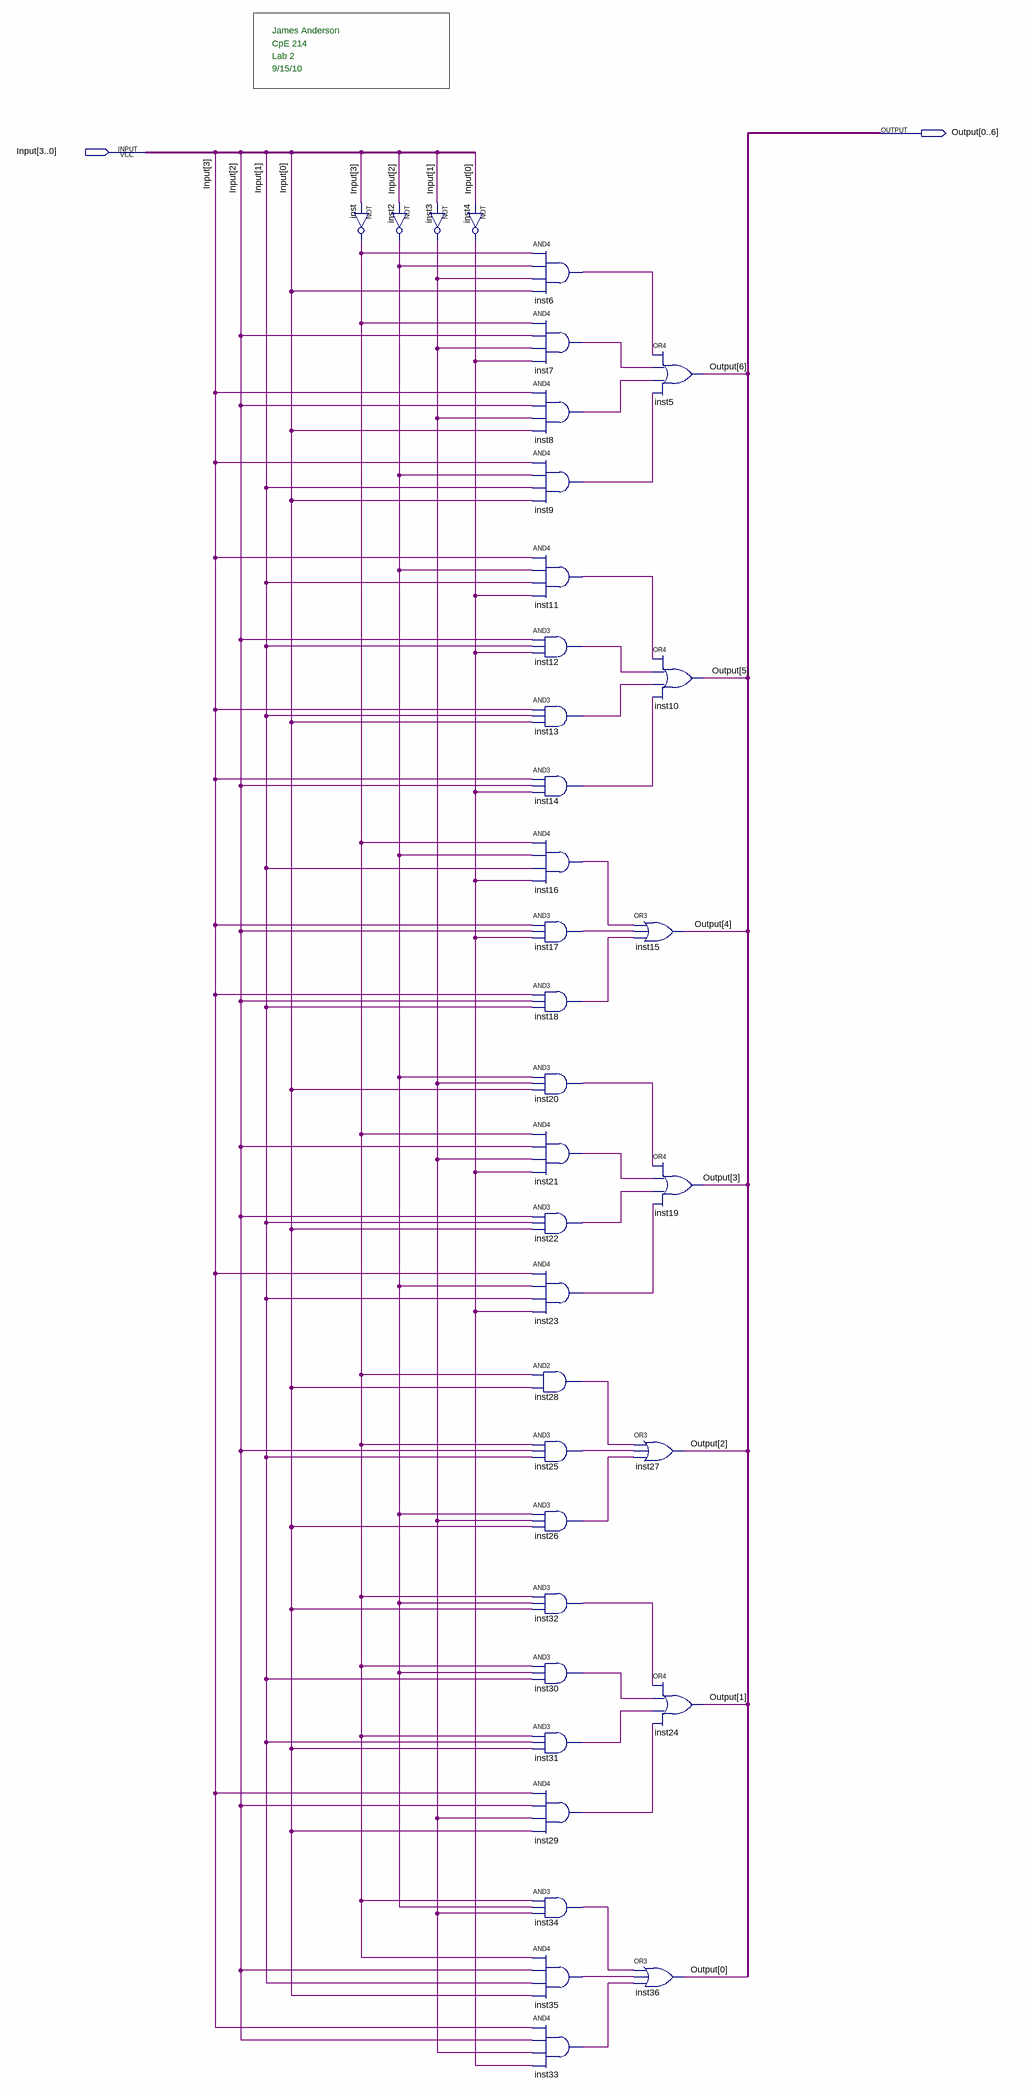
[diagram p0: schematic sheet]
// Quartus schematic 7_seg_dec.bdf as structural Verilog: 36 symbols, 2 pins
module \7_seg_dec  (
  input  [3:0] Input,
  output [0:6] Output
);

  wire inst2_out, inst3_out, inst4_out, inst6_out, inst7_out, inst8_out, inst9_out, inst11_out, inst12_out,
       inst13_out, inst14_out, inst16_out, inst17_out, inst18_out, inst20_out, inst21_out, inst22_out,
       inst23_out, inst25_out, inst26_out, inst28_out, inst29_out, inst30_out, inst31_out, inst32_out,
       inst33_out, inst34_out, inst35_out, inst_out;

  not inst (inst_out, Input[3]);
  not inst2 (inst2_out, Input[2]);
  not inst3 (inst3_out, Input[1]);
  not inst4 (inst4_out, Input[0]);
  and inst6 (inst6_out, inst_out, inst2_out, inst3_out, Input[0]);
  and inst7 (inst7_out, inst_out, Input[2], inst3_out, inst4_out);
  and inst8 (inst8_out, Input[3], Input[2], inst3_out, Input[0]);
  and inst9 (inst9_out, Input[3], inst2_out, Input[1], Input[0]);
  and inst11 (inst11_out, Input[3], inst2_out, Input[1], inst4_out);
  and inst12 (inst12_out, Input[2], Input[1], inst4_out);
  and inst13 (inst13_out, Input[3], Input[1], Input[0]);
  and inst14 (inst14_out, Input[3], Input[2], inst4_out);
  and inst16 (inst16_out, inst_out, inst2_out, Input[1], inst4_out);
  and inst17 (inst17_out, Input[3], Input[2], inst4_out);
  and inst18 (inst18_out, Input[3], Input[2], Input[1]);
  and inst20 (inst20_out, inst2_out, inst3_out, Input[0]);
  and inst21 (inst21_out, inst_out, Input[2], inst3_out, inst4_out);
  and inst22 (inst22_out, Input[2], Input[1], Input[0]);
  and inst23 (inst23_out, Input[3], inst2_out, Input[1], inst4_out);
  and inst28 (inst28_out, inst_out, Input[0]);
  and inst25 (inst25_out, inst_out, Input[2], Input[1]);
  and inst26 (inst26_out, inst2_out, inst3_out, Input[0]);
  and inst32 (inst32_out, inst_out, inst2_out, Input[0]);
  and inst30 (inst30_out, inst_out, inst2_out, Input[1]);
  and inst31 (inst31_out, inst_out, Input[1], Input[0]);
  and inst29 (inst29_out, Input[3], Input[2], inst3_out, Input[0]);
  and inst34 (inst34_out, inst_out, inst2_out, inst3_out);
  and inst35 (inst35_out, inst_out, Input[2], Input[1], Input[0]);
  and inst33 (inst33_out, Input[3], Input[2], inst3_out, inst4_out);
  or inst15 (Output[4], inst16_out, inst17_out, inst18_out);
  or inst27 (Output[2], inst28_out, inst25_out, inst26_out);
  or inst36 (Output[0], inst34_out, inst35_out, inst33_out);
  or inst5 (Output[6], inst6_out, inst7_out, inst8_out, inst9_out);
  or inst10 (Output[5], inst11_out, inst12_out, inst13_out, inst14_out);
  or inst19 (Output[3], inst20_out, inst21_out, inst22_out, inst23_out);
  or inst24 (Output[1], inst32_out, inst30_out, inst31_out, inst29_out);

  // Notes on the sheet:
  //   James Anderson
  //   CpE 214
  //   Lab 2
  //   9/15/10
endmodule
